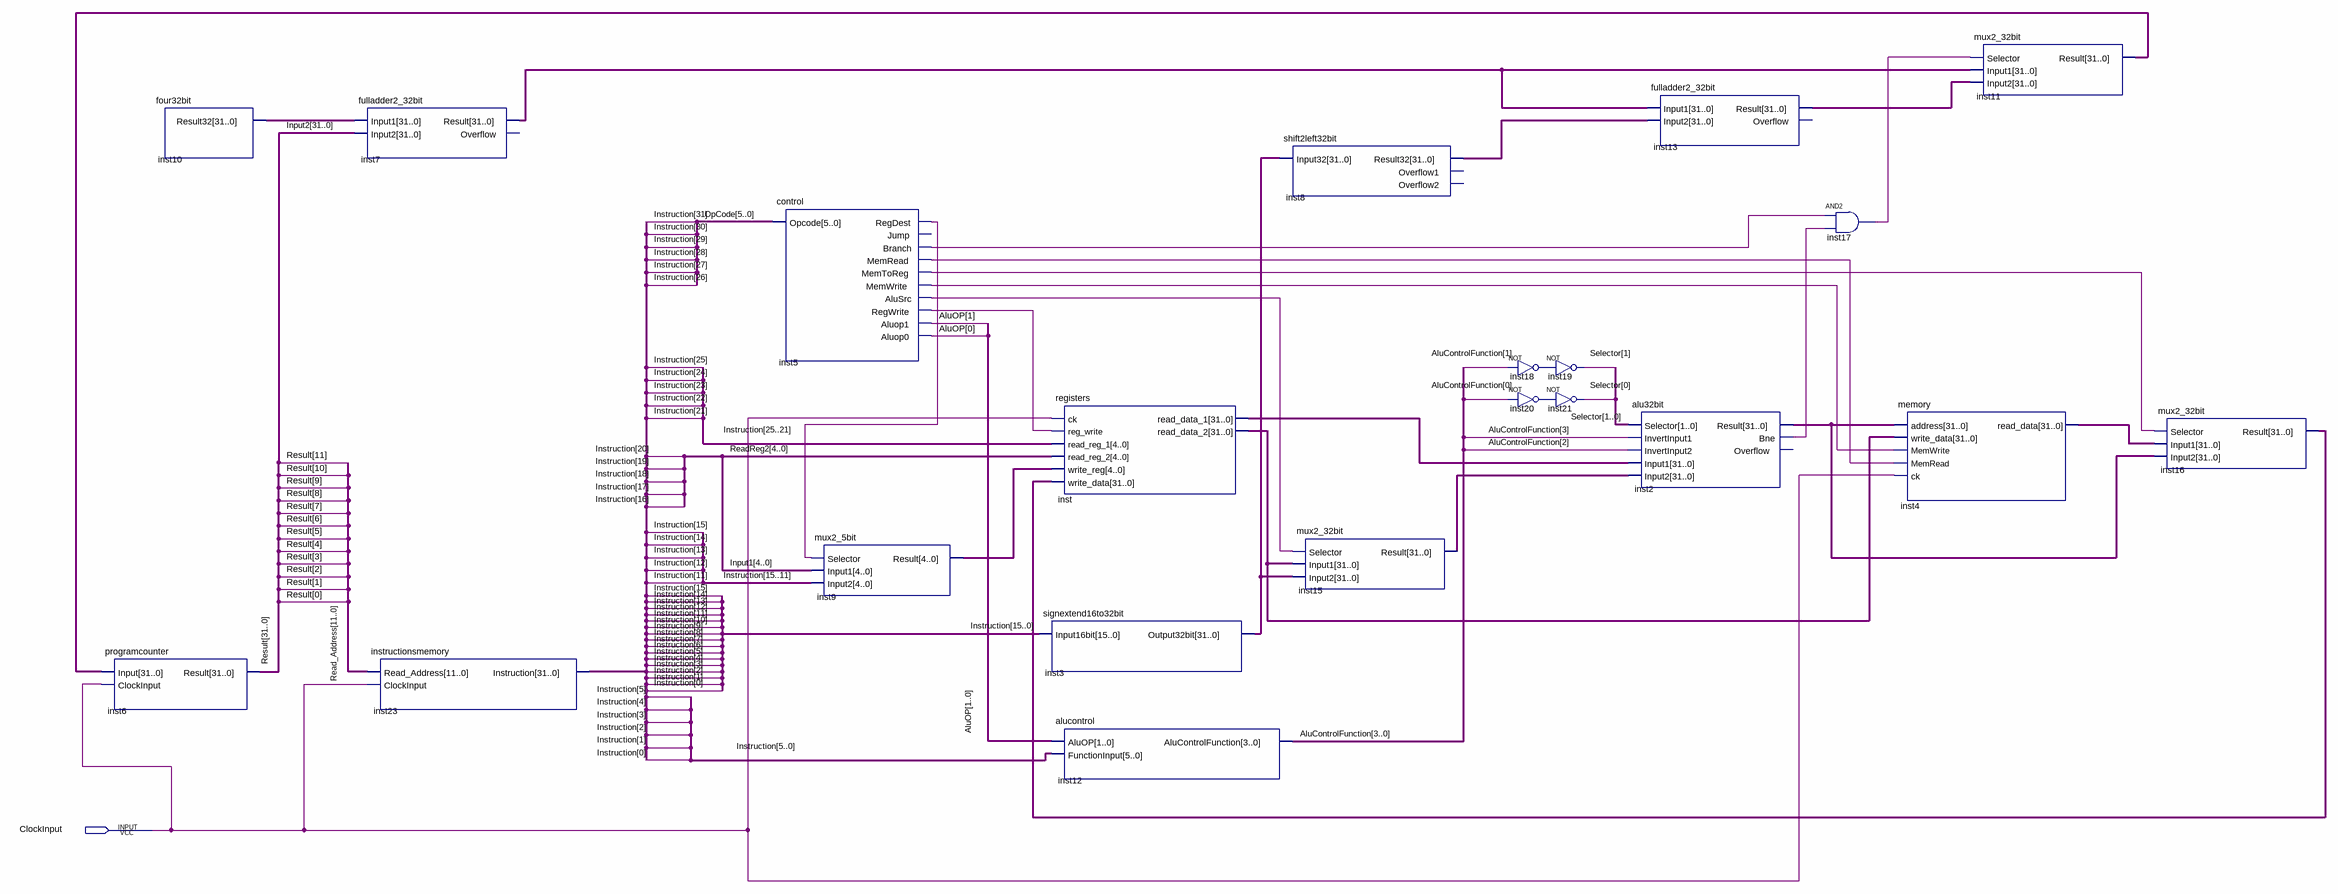
[diagram p0: schematic sheet]
// Quartus schematic Lab2MipsUnicycle.bdf as structural Verilog: 21 symbols, 1 pins
module Lab2MipsUnicycle (
  input  ClockInput
);

  wire inst2_bne, inst5_alusrc, inst5_branch, inst5_memread, inst5_memtoreg, inst5_memwrite, inst5_regdest,
       inst5_regwrite, inst17_out, inst18_out, inst20_out;
  wire [1:0] AluOP, Selector;
  wire [3:0] AluControlFunction;
  wire [4:0] Input1, inst9_result, ReadReg2;
  wire [5:0] OpCode;
  wire [11:0] Read_Address;
  wire [25:0] Instruction;
  wire [31:0] Input2, inst2_result, inst3_output32bit, inst4_read_data, inst7_result, inst8_result32,
       inst10_result32, inst11_result, inst13_result, inst15_result, inst16_result, inst23_instruction,
       inst_read_data_1, inst_read_data_2, Result;

  programcounter inst6 (.Input(inst11_result), .ClockInput(ClockInput), .Result(Result));
  four32bit inst10 (.Result32(inst10_result32));
  fulladder2_32bit inst7 (.Input1(inst10_result32), .Input2(Input2), .Result(inst7_result));  // open: Overflow
  instructionsmemory inst23 (.Read_Address(Read_Address), .ClockInput(ClockInput), .Instruction(inst23_instruction));
  control inst5 (
    .Opcode(OpCode), .RegDest(inst5_regdest), .Branch(inst5_branch), .MemRead(inst5_memread),
    .MemToReg(inst5_memtoreg), .MemWrite(inst5_memwrite), .AluSrc(inst5_alusrc), .RegWrite(inst5_regwrite),
    .Aluop1(AluOP[1]), .Aluop0(AluOP[0]));  // open: Jump
  mux2_5bit inst9 (.Selector(inst5_regdest), .Input1(Input1), .Input2(Instruction[15:11]), .Result(inst9_result));
  registers inst (
    .ck(ClockInput), .reg_write(inst5_regwrite), .read_reg_1(Instruction[25:21]), .read_reg_2(ReadReg2),
    .write_reg(inst9_result), .write_data(inst16_result), .read_data_1(inst_read_data_1),
    .read_data_2(inst_read_data_2));
  signextend16to32bit inst3 (.Input16bit(Instruction[15:0]), .Output32bit(inst3_output32bit));
  alucontrol inst12 (.AluOP(AluOP), .FunctionInput(Instruction[5:0]), .AluControlFunction(AluControlFunction));
  shift2left32bit inst8 (.Input32(inst3_output32bit), .Result32(inst8_result32));  // open: Overflow1, Overflow2
  mux2_32bit inst15 (
    .Selector(inst5_alusrc), .Input1(inst_read_data_2), .Input2(inst3_output32bit), .Result(inst15_result));
  not inst18 (inst18_out, AluControlFunction[1]);
  not inst20 (inst20_out, AluControlFunction[0]);
  not inst19 (Selector[1], inst18_out);
  not inst21 (Selector[0], inst20_out);
  alu32bit inst2 (
    .Selector(Selector), .InvertInput1(AluControlFunction[3]), .InvertInput2(AluControlFunction[2]),
    .Input1(inst_read_data_1), .Input2(inst15_result), .Result(inst2_result), .Bne(inst2_bne));  // open: Overflow
  fulladder2_32bit inst13 (.Input1(inst7_result), .Input2(inst8_result32), .Result(inst13_result));  // open: Overflow
  and inst17 (inst17_out, inst5_branch, inst2_bne);
  memory inst4 (
    .address(inst2_result), .write_data(inst_read_data_2), .MemWrite(inst5_memwrite),
    .MemRead(inst5_memread), .ck(ClockInput), .read_data(inst4_read_data));
  mux2_32bit inst11 (.Selector(inst17_out), .Input1(inst7_result), .Input2(inst13_result), .Result(inst11_result));
  mux2_32bit inst16 (
    .Selector(inst5_memtoreg), .Input1(inst4_read_data), .Input2(inst2_result), .Result(inst16_result));
endmodule
